# Altium schematic sheet 6_Axis.SchDoc
size A
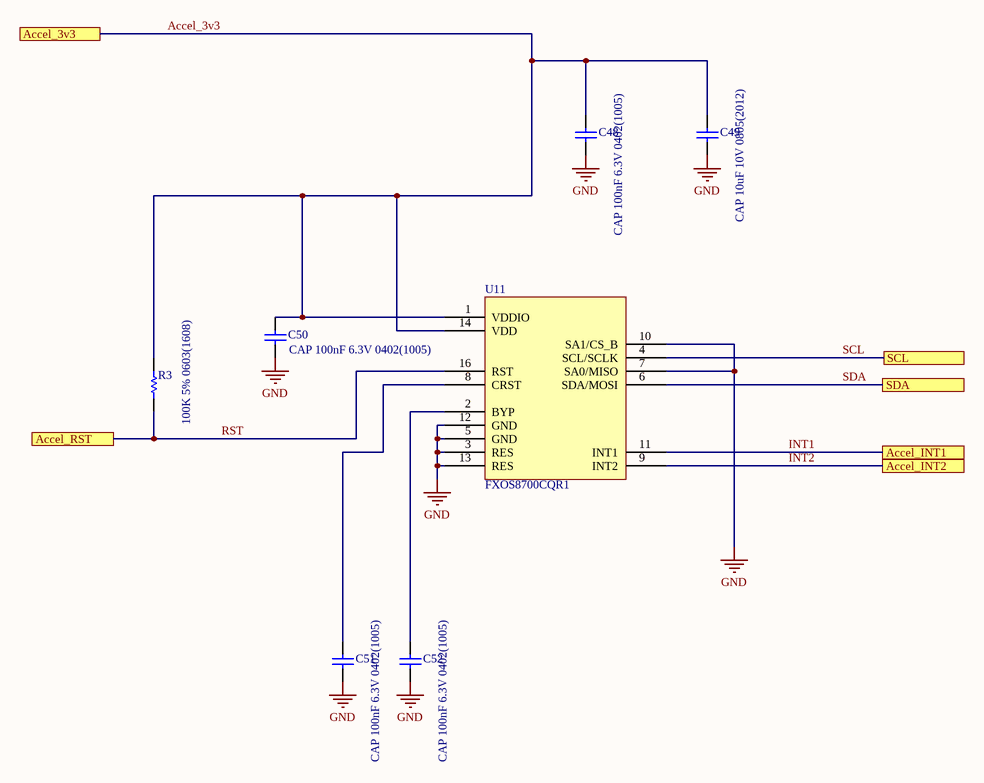
[diagram p0: 6_Axis.SchDoc]

## Parts
C48  CAP 100nF 6.3V 0402(1005)  [CAPC0402(1005)60_M]
C49  CAP 10uF 10V 0805(2012)  [CAPC0805(2012)145_N]
C50  CAP 100nF 6.3V 0402(1005)  [CAPC0402(1005)60_M]
C51  CAP 100nF 6.3V 0402(1005)  [CAPC0402(1005)60_M]
C52  CAP 100nF 6.3V 0402(1005)  [CAPC0402(1005)60_M]
R3  100K 5% 0603(1608)  [RESC0603(1608)_N]
U11  FXOS8700CQR1  [QFN50P300X300X120-16N]

## Ports
Accel_3v3, Accel_INT1, Accel_INT2, Accel_RST, SCL, SDA

## Nets
GND: C48.1 C49.2 C50.1 C51.1 C52.1 U11.3(RES) U11.5(GND) U11.7(SA0/MISO) U11.10(SA1/CS_B) U11.12(GND) U11.13(RES)
Accel_3v3: C48.2 C49.1 C50.2 R3.2 U11.1(VDDIO) U11.14(VDD) ; port Accel_3v3
INT1: U11.11(INT1) ; port Accel_INT1
INT2: U11.9(INT2) ; port Accel_INT2
RST: R3.1 U11.16(RST) ; port Accel_RST
SCL: U11.4(SCL/SCLK) ; port SCL
SDA: U11.6(SDA/MOSI) ; port SDA
NetC51_2: C51.2 U11.8(CRST)
NetC52_2: C52.2 U11.2(BYP)

## Library data of the parts
C48 C50-C52 = CMP-1034-02062-1: CAP 100nF 6.3V ±20% 0402 (1005 Metric) Thickness 0.6mm SMD; Case-EIA: 0402; Tolerance: Â±20%; Case-Metric: 1005; Value: 100nF; Technology: SMT; Max Thickness: 0.6 mm; Rated Voltage: 6.3 V
C49 = CMP-1036-04924-1: CAP 10uF 10V ±20% 0805 (2012 Metric) Thickness 1.45mm SMD; Case-EIA: 0805; Case-Metric: 2012; Tolerance: Â±20%; Rated Voltage: 10 V; Max Thickness: 1.45 mm; Value: 10uF; Technology: SMT
R3 = CMP-1012-00122-1: 100K 0.1W 5% 0603 (1608 Metric)  SMD; Case-EIA: 0603; Value: 100000.00 Ohm; Case-Metric: 1608; Tolerance: 5 %; Power: 0.1 W; Technology: SMT
U11 = FXOS8700CQR1: 6-axis sensor with integrated linear accelerometer and magnetometer